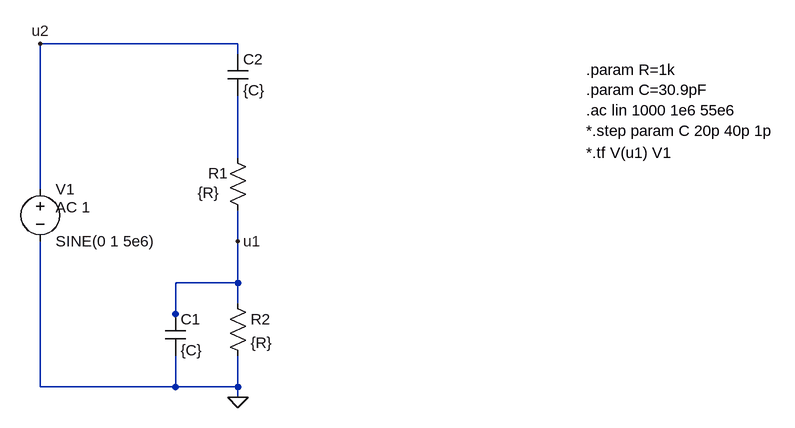
[diagram p0: schematic Wien-LT-FT-Test.asc]
Wien-LT-FT-Test.asc, the LTspice schematic file:
Version 4
SHEET 1 1468 680
WIRE 192 -2704 -112 -2704
WIRE 192 -2688 192 -2704
WIRE 192 -2528 192 -2624
WIRE -112 -2480 -112 -2704
WIRE 192 -2400 192 -2448
WIRE 192 -2336 192 -2400
WIRE 192 -2336 96 -2336
WIRE 192 -2304 192 -2336
WIRE 96 -2288 96 -2336
WIRE 96 -2272 96 -2288
WIRE -112 -2176 -112 -2400
WIRE 96 -2176 96 -2224
WIRE 96 -2176 -112 -2176
WIRE 192 -2176 192 -2224
WIRE 192 -2176 96 -2176
WIRE 192 -2160 192 -2176
FLAG 192 -2160 0
FLAG 192 -2400 u1
FLAG -112 -2704 u2
SYMBOL cap 80 -2288 R0
SYMATTR InstName C1
SYMATTR Value {C}
SYMBOL cap 176 -2688 R0
SYMATTR InstName C2
SYMATTR Value {C}
SYMBOL res 176 -2320 R0
SYMATTR InstName R2
SYMATTR Value {R}
SYMBOL res 176 -2544 R0
WINDOW 0 -30 39 Left 2
WINDOW 3 -46 69 Left 2
SYMATTR InstName R1
SYMATTR Value {R}
SYMBOL voltage -112 -2496 R0
WINDOW 123 24 44 Left 2
WINDOW 39 0 0 Left 0
SYMATTR InstName V1
SYMATTR Value SINE(0 1 5e6)
SYMATTR Value2 AC 1
TEXT 728 -2664 Left 2 !.param R=1k\n.param C=30.9pF\n.ac lin 1000 1e6 55e6\n*.step param C 20p 40p 1p
TEXT 728 -2536 Left 2 !*.tf V(u1) V1

The netlist it stands for:
* Wien-LT-FT-Test.asc
C1 u1 0 {C}
C2 u2 N001 {C}
R2 u1 0 {R}
R1 N001 u1 {R}
V1 u2 0 SINE(0 1 5e6) AC 1
.param R=1k
.param C=30.9pF
.ac lin 1000 1e6 55e6
*.step param C 20p 40p 1p
*.tf V(u1) V1
.backanno
.end